# EAGLE schematic ir2110_hbridge_mosfet (EAGLE 6.5.0)
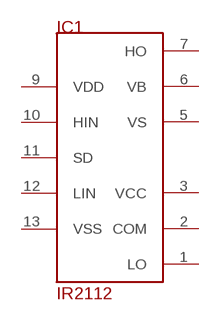
[diagram p0: schematic, sheet 1]

## Parts
IC1  IR2112  [DIL14]
Unconnected: IC1.1(LO) IC1.2(COM) IC1.3(VCC) IC1.5(VS) IC1.6(VB) IC1.7(HO) IC1.9(VDD) IC1.10(HIN) IC1.11(SD) IC1.12(LIN) IC1.13(VSS)

## Library data of the parts
IC1 = ir2112:IR2112